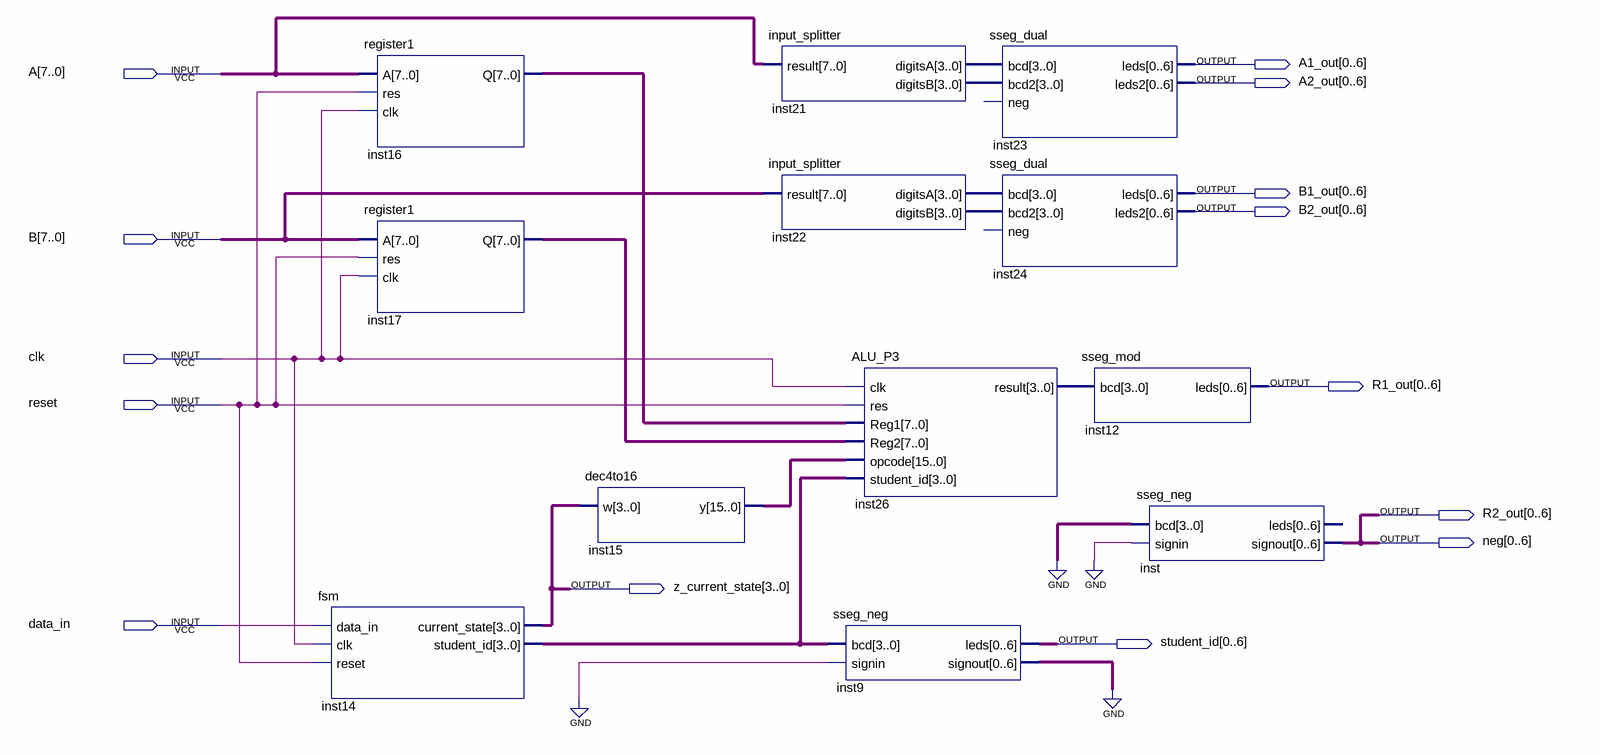
[diagram p0: schematic sheet]
// Quartus schematic CPUp3.bdf as structural Verilog: 12 symbols, 14 pins
module CPUp3 (
  input  [7:0] A,
  input  [7:0] B,
  input  clk,
  input  reset,
  input  data_in,
  output [0:6] A1_out,
  output [0:6] A2_out,
  output [0:6] B1_out,
  output [0:6] B2_out,
  output [0:6] R1_out,
  output [0:6] R2_out,
  output [0:6] neg,
  output [3:0] z_current_state,
  output [0:6] student_id
);

  wire [3:0] inst14_student_id, inst21_digitsa, inst21_digitsb, inst22_digitsa, inst22_digitsb, inst26_result;
  wire [6:0] inst9_signout;
  wire [7:0] inst16_q, inst17_q;
  wire [15:0] inst15_y;

  fsm inst14 (
    .data_in(data_in), .clk(clk), .reset(reset), .current_state(z_current_state),
    .student_id(inst14_student_id));
  register1 inst16 (.A(A), .res(reset), .clk(clk), .Q(inst16_q));
  register1 inst17 (.A(B), .res(reset), .clk(clk), .Q(inst17_q));
  dec4to16 inst15 (.w(z_current_state), .y(inst15_y));
  input_splitter inst21 (.result(A), .digitsA(inst21_digitsa), .digitsB(inst21_digitsb));
  input_splitter inst22 (.result(B), .digitsA(inst22_digitsa), .digitsB(inst22_digitsb));
  ALU_P3 inst26 (
    .clk(clk), .res(reset), .Reg1(inst16_q), .Reg2(inst17_q), .opcode(inst15_y),
    .student_id(inst14_student_id), .result(inst26_result));
  sseg_neg inst9 (.bcd(inst14_student_id), .signin(1'b0), .leds(student_id), .signout(inst9_signout));
  sseg_dual inst23 (.bcd(inst21_digitsa), .bcd2(inst21_digitsb), .leds(A1_out), .leds2(A2_out));  // open: neg
  sseg_dual inst24 (.bcd(inst22_digitsa), .bcd2(inst22_digitsb), .leds(B1_out), .leds2(B2_out));  // open: neg
  sseg_mod inst12 (.bcd(inst26_result), .leds(R1_out));
  sseg_neg inst (.bcd(4'b0000), .signin(1'b0), .signout(neg));  // open: leds

  assign R2_out = neg;
  // also tied to GND on the sheet: {inst9_signout[0], inst9_signout[1], inst9_signout[2], inst9_signout[3], inst9_signout[4], inst9_signout[5], inst9_signout[6]}
endmodule
